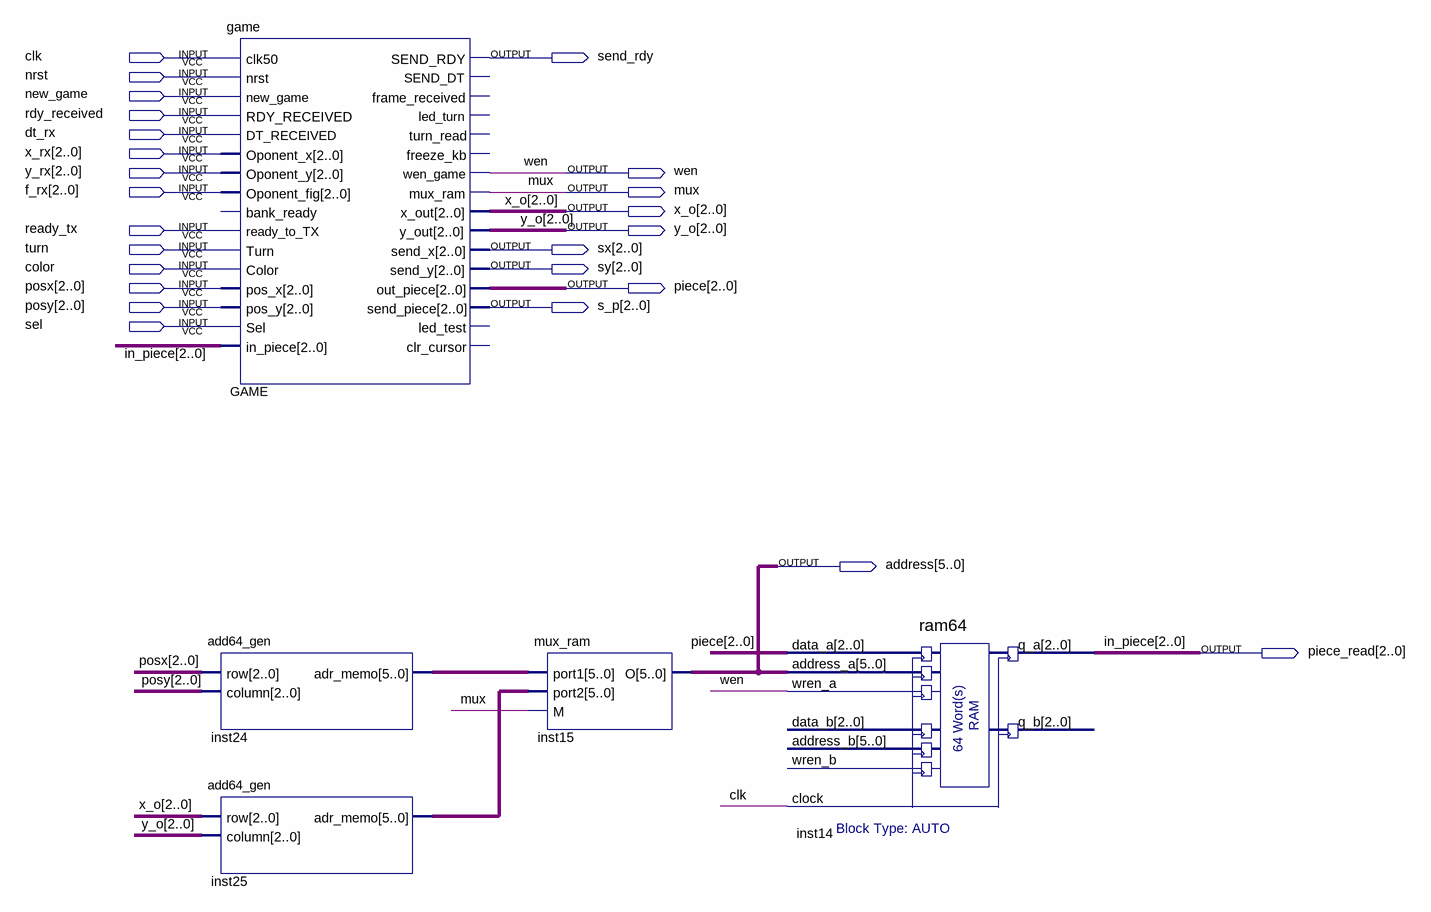
[diagram p0: schematic sheet]
// Quartus schematic sim_game.bdf as structural Verilog: 5 symbols, 25 pins
module sim_game (
  input  clk,
  input  nrst,
  input  new_game,
  input  rdy_received,
  input  dt_rx,
  input  [2:0] x_rx,
  input  [2:0] y_rx,
  input  [2:0] f_rx,
  input  ready_tx,
  input  turn,
  input  color,
  input  [2:0] posx,
  input  [2:0] posy,
  input  sel,
  output send_rdy,
  output wen,
  output mux,
  output [2:0] x_o,
  output [2:0] y_o,
  output [2:0] sx,
  output [2:0] sy,
  output [2:0] piece,
  output [2:0] s_p,
  output [5:0] address,
  output [2:0] piece_read
);

  wire [5:0] inst24_adr_memo, inst25_adr_memo;

  game GAME (
    .clk50(clk), .nrst(nrst), .new_game(new_game), .RDY_RECEIVED(rdy_received), .DT_RECEIVED(dt_rx),
    .Oponent_x(x_rx), .Oponent_y(y_rx), .Oponent_fig(f_rx), .ready_to_TX(ready_tx), .Turn(turn),
    .Color(color), .pos_x(posx), .pos_y(posy), .Sel(sel), .in_piece(piece_read), .SEND_RDY(send_rdy),
    .wen_game(wen), .mux_ram(mux), .x_out(x_o), .y_out(y_o), .send_x(sx), .send_y(sy), .out_piece(piece),
    .send_piece(s_p));  // open: bank_ready, SEND_DT, frame_received, led_turn, turn_read, freeze_kb, led_test, clr_cursor
  add64_gen inst24 (.row(posx), .column(posy), .adr_memo(inst24_adr_memo));
  add64_gen inst25 (.row(x_o), .column(y_o), .adr_memo(inst25_adr_memo));
  mux_ram inst15 (.port1(inst24_adr_memo), .port2(inst25_adr_memo), .M(mux), .O(address));
  ram64 inst14 (
    .data_a(piece), .address_a(address), .wren_a(wen), .clock(clk), .q_a(piece_read));  // open: data_b, address_b, wren_b, q_b

  // Other names for the same wires on the sheet: in_piece[2:0] = piece_read
endmodule
